# Altium schematic sheet Sheet1.SchDoc
size A
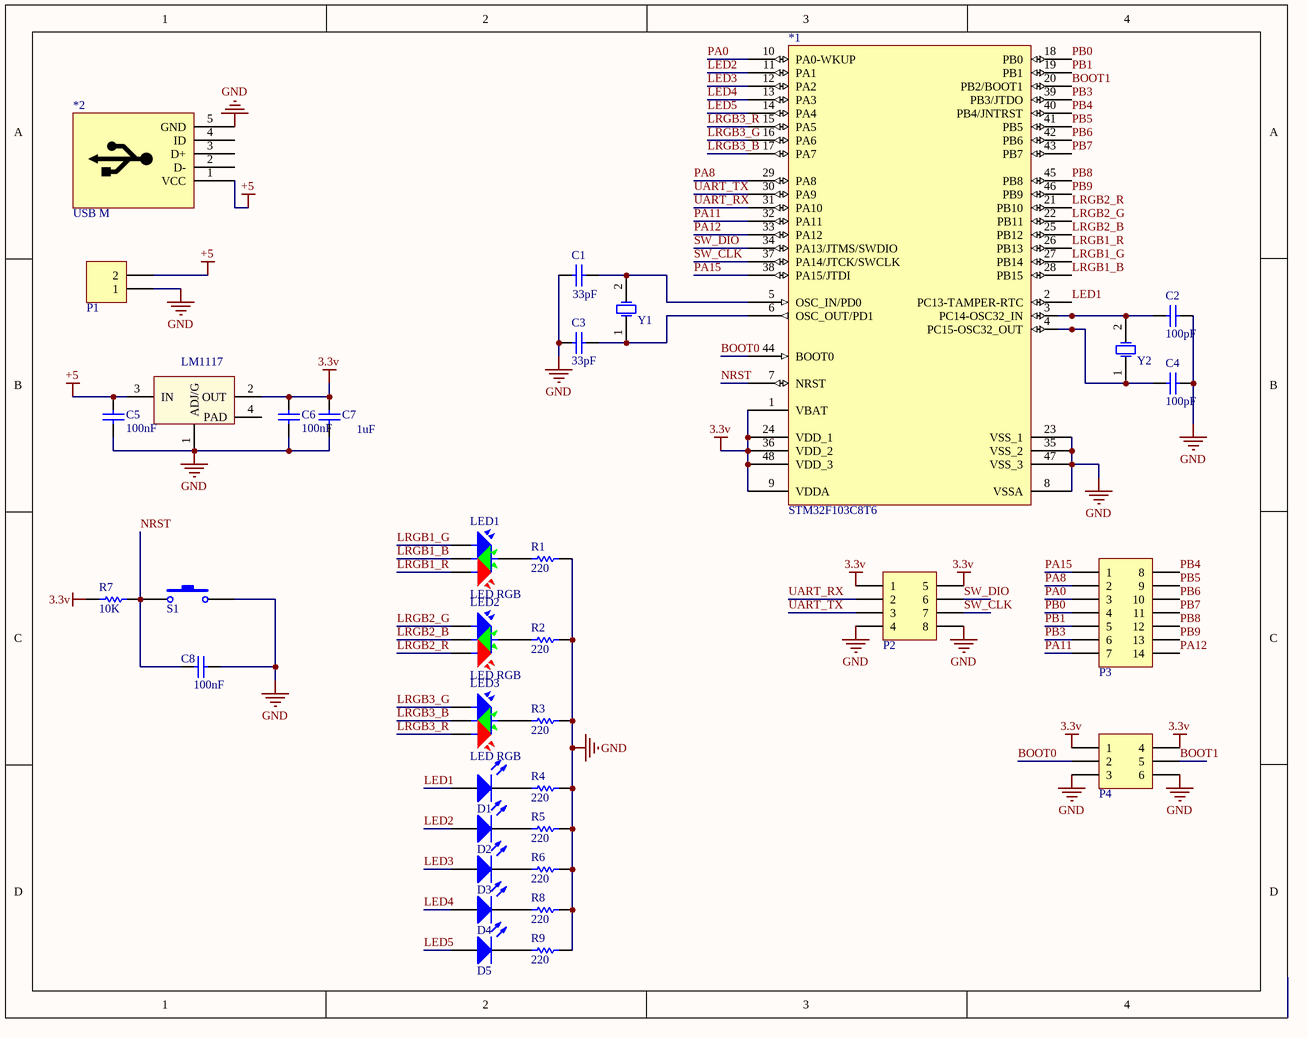
[diagram p0: Sheet1.SchDoc]

## Parts
*1  STM32F103C8T6  [TSQFP50P900X900X160-48N]
*2  USB M  [USB-B-MINI-SMD]
C1  value 33pF  [CAP-SM-0805]  (hidden comment: Cap Non-Pol SMD)
C2  value 100pF  [CAP-SM-0805]  (hidden comment: Cap Non-Pol SMD)
C3  value 33pF  [CAP-SM-0805]  (hidden comment: Cap Non-Pol SMD)
C4  value 100pF  [CAP-SM-0805]  (hidden comment: Cap Non-Pol SMD)
C5  value 100nF  [CAP-SM-0805]  (hidden comment: Cap Non-Pol SMD)
C6  value 100nF  [CAP-SM-0805]  (hidden comment: Cap Non-Pol SMD)
C7  value 1uF  [CAP-SM-0805]  (hidden comment: Cap Non-Pol SMD)
C8  value 100nF  [CAP-SM-0805]  (hidden comment: Cap Non-Pol SMD)
D1  LED SMD  [LED_0603_Blue]  (value not drawn)
D2  LED SMD  [LED_0603_Blue]  (value not drawn)
D3  LED SMD  [LED_0603_Blue]  (value not drawn)
D4  LED SMD  [LED_0603_Blue]  (value not drawn)
D5  LED SMD  [LED_0603_Blue]  (value not drawn)
LED1  LED RGB  [led rgb]
LED2  LED RGB  [led rgb]
LED3  LED RGB  [led rgb]
LM1117  LM1117  [SOT223-4N]  (value not drawn)
P1  Domino 2  [DOMINO 2- 5mm]  (value not drawn)
P2  Header 4X2  [JP4x2]  (value not drawn)
P3  Header 7X2  [JP7X2]  (value not drawn)
P4  Header 3X2  [JP3x2]  (value not drawn)
R1  value 220  [RES-SM-0603]  (hidden comment: RESISTOR SMD)
R2  value 220  [RES-SM-0603]  (hidden comment: RESISTOR SMD)
R3  value 220  [RES-SM-0603]  (hidden comment: RESISTOR SMD)
R4  value 220  [RES-SM-0603]  (hidden comment: RESISTOR SMD)
R5  value 220  [RES-SM-0603]  (hidden comment: RESISTOR SMD)
R6  value 220  [RES-SM-0603]  (hidden comment: RESISTOR SMD)
R7  value 10K  [RES-SM-0603]  (hidden comment: RESISTOR SMD)
R8  value 220  [RES-SM-0603]  (hidden comment: RESISTOR SMD)
R9  value 220  [RES-SM-0603]  (hidden comment: RESISTOR SMD)
S1  Tact SW - 2Pin  [SW2]  (value not drawn)
Y1  XTAL  [XTAL 32KN]  (value not drawn)
Y2  XTAL  [XTAL 32KN]  (value not drawn)

## Nets
3.3v: *1.1(VBAT) *1.9(VDDA) *1.24(VDD_1) *1.36(VDD_2) *1.48(VDD_3) C6.1 C7.1 LM1117.2(OUT) P2.1 P2.5 P4.1 P4.4 R7.1
+5: *2.1(VCC) C5.1 LM1117.3(IN) P1.2
GND: *1.8(VSSA) *1.23(VSS_1) *1.35(VSS_2) *1.47(VSS_3) *2.5(GND) C1.1 C2.2 C3.1 C4.2 C5.2 C6.2 C7.2 C8.2 LM1117.1(ADJ/G) P1.1 P2.4 P2.8 P4.3 P4.6 R1.1 R2.1 R3.1 R4.1 R5.1 R6.1 R8.1 R9.1 S1.2
BOOT0: *1.44(BOOT0) P4.2
BOOT1: *1.20(PB2/BOOT1) P4.5
LED1: *1.2(PC13-TAMPER-RTC) D1.1(A)
LED2: *1.11(PA1) D2.1(A)
LED3: *1.12(PA2) D3.1(A)
LED4: *1.13(PA3) D4.1(A)
LED5: *1.14(PA4) D5.1(A)
LRGB1_B: *1.28(PB15) LED1.1
LRGB1_G: *1.27(PB14) LED1.2
LRGB1_R: *1.26(PB13) LED1.4
LRGB2_B: *1.25(PB12) LED2.1
LRGB2_G: *1.22(PB11) LED2.2
LRGB2_R: *1.21(PB10) LED2.4
LRGB3_B: *1.17(PA7) LED3.1
LRGB3_G: *1.16(PA6) LED3.2
LRGB3_R: *1.15(PA5) LED3.4
NRST: *1.7(NRST) C8.1 R7.2 S1.1
PA0: *1.10(PA0-WKUP) P3.3
PA8: *1.29(PA8) P3.2
PA11: *1.32(PA11) P3.7
PA12: *1.33(PA12) P3.14
PA15: *1.38(PA15/JTDI) P3.1
PB0: *1.18(PB0) P3.4
PB1: *1.19(PB1) P3.5
PB3: *1.39(PB3/JTDO) P3.6
PB4: *1.40(PB4/JNTRST) P3.8
PB5: *1.41(PB5) P3.9
PB6: *1.42(PB6) P3.10
PB7: *1.43(PB7) P3.11
PB8: *1.45(PB8) P3.12
PB9: *1.46(PB9) P3.13
SW_CLK: *1.37(PA14/JTCK/SWCLK) P2.7
SW_DIO: *1.34(PA13/JTMS/SWDIO) P2.6
UART_RX: *1.31(PA10) P2.2
UART_TX: *1.30(PA9) P2.3
Net*1_3: *1.3(PC14-OSC32_IN) C2.1 Y2.2(OSC2)
Net*1_4: *1.4(PC15-OSC32_OUT) C4.1 Y2.1(OSC1)
Net*1_5: *1.5(OSC_IN/PD0) C1.2 Y1.2(OSC2)
Net*1_6: *1.6(OSC_OUT/PD1) C3.2 Y1.1(OSC1)
NetD1_2: D1.2(K) R4.2
NetD2_2: D2.2(K) R5.2
NetD3_2: D3.2(K) R6.2
NetD4_2: D4.2(K) R8.2
NetD5_2: D5.2(K) R9.2
NetLED1_3: LED1.3 R1.2
NetLED2_3: LED2.3 R2.2
NetLED3_3: LED3.3 R3.2

Not connected (* = marked no-connect by the designer): *2 2(D-) 3(D+) 4(ID); LM1117 4(PAD)

## Library data of the parts
*1 = STM32F103C8T6: Manufacturer: ST; ComponentLink1Description: Supplier 1 Link
C1-C8 = Cap Non-Pol SMD: Capacitor
D1-D5 = LED SMD: LED
LM1117 = LM1117: Available in 1.8V, 2.5V, 2.85V, 3.3V, 5V, and  Adjustable Versions; Value: LM317
P1 = Domino 2: Domino, 2-Pin; LatestRevisionDate: 17-Jul-2002; LatestRevisionNote: Re-released for DXP Platform.; Publisher: Altium Limited
P2 = Header 4X2: Header, 4-Pin, Dual row; LatestRevisionDate: 17-Jul-2002; LatestRevisionNote: Re-released for DXP Platform.; Publisher: Altium Limited
P3 = Header 7X2: Header, 7-Pin, Dual row; LatestRevisionDate: 17-Jul-2002; LatestRevisionNote: Re-released for DXP Platform.; Publisher: Altium Limited
P4 = Header 3X2: Header, 3-Pin, Dual row; LatestRevisionDate: 17-Jul-2002; LatestRevisionNote: Re-released for DXP Platform.; Publisher: Altium Limited
R1-R9 = RESISTOR SMD: Resistor
S1 = Tact SW - 2Pin: Switch button 2 pin
Y1 Y2 = XTAL: Crystal Oscillator; Published: 8-Jun-2000; LatestRevisionDate: 17-Jul-2002; LatestRevisionNote: Re-released for DXP Platform.; PackageReference: R38; Publisher: Altium Limited; PackageDescription: Crystal, Thru-Hole; 2 Leads; Body 3.1 x 8.2 mm (Dia.xH)